# EAGLE design M783new (EAGLE 6.6.0)
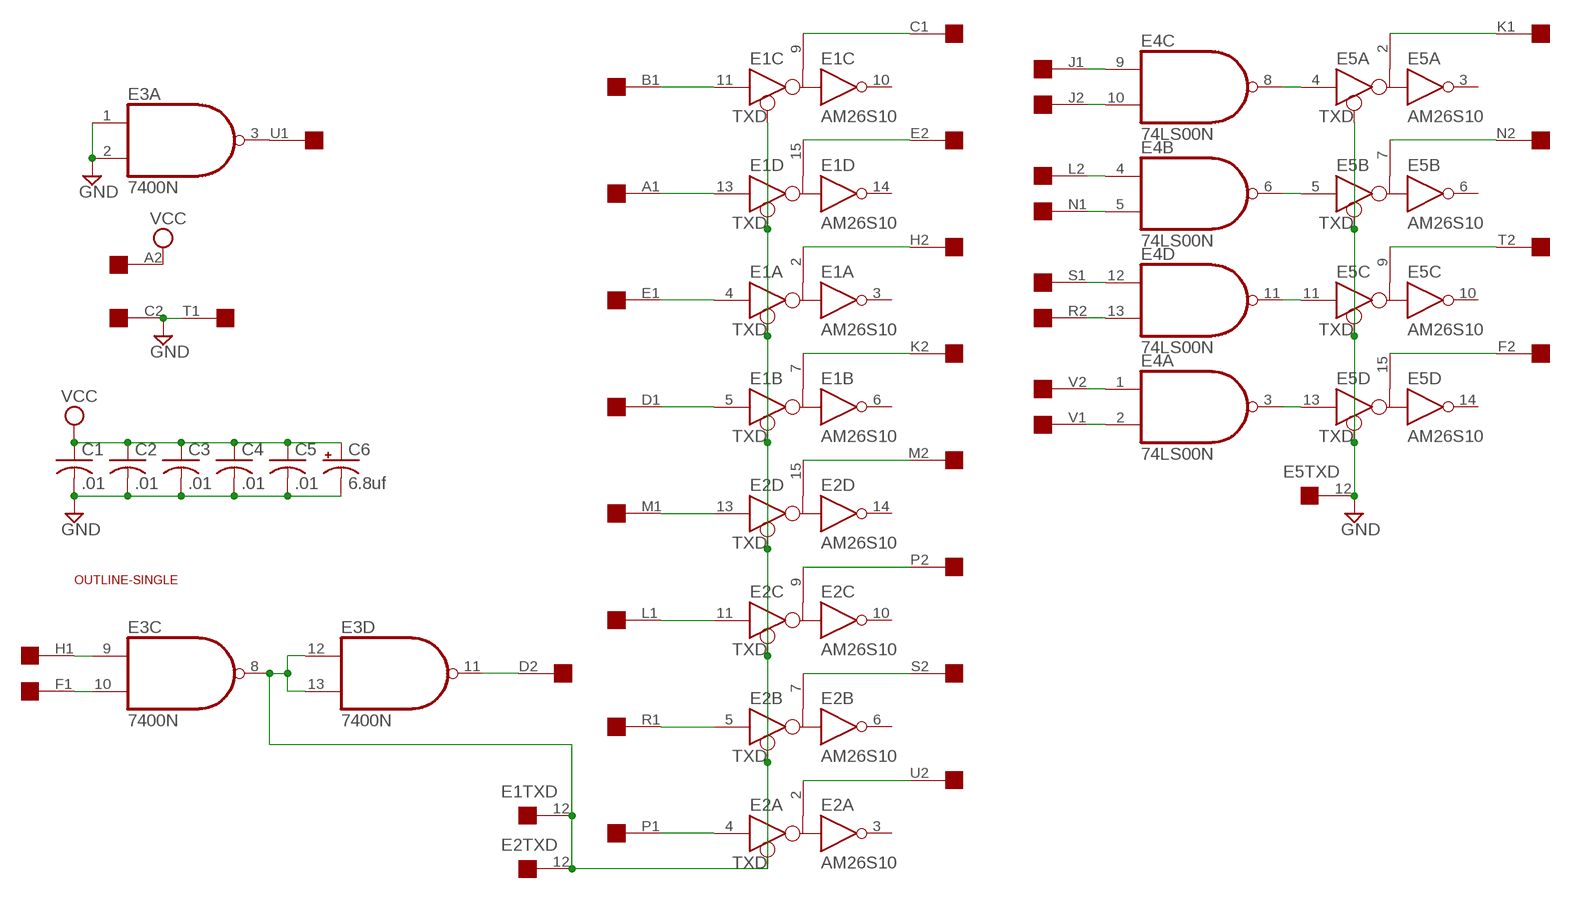
[diagram p0: schematic, sheet 1]

## Parts
C1  .01  C-US050-025X075  [C050-025X075]
C2  .01  C-US050-025X075  [C050-025X075]
C3  .01  C-US050-025X075  [C050-025X075]
C4  .01  C-US050-025X075  [C050-025X075]
C5  .01  C-US050-025X075  [C050-025X075]
C6  6.8uf  CPOL-USE15-5AXIAL  [E15-5]
E1  AM26S10  [DIL16]
E2  AM26S10  [DIL16]
E3  7400N  [DIL14]
E4  74LS00N  [DIL14]
E5  AM26S10  [DIL16]
U$1  SINGLE  [EDGE-CON2]
U$2  OUTLINE-SINGLE  [SINGLE]

## Nets
GND: C1.2 C2.2 C3.2 C4.2 C5.2 C6.- E3.1(A:I0) E3.2(A:I1) E5.12(TXD:TXD) U$1.C2 U$1.T1
N$1: E3.3(A:O) U$1.U1
N$2: E1.12(TXD:TXD) E2.12(TXD:TXD) E3.8(C:O) E3.12(D:I0) E3.13(D:I1)
N$3: E2.15(D:B) U$1.M2
N$4: E2.9(C:B) U$1.P2
N$5: E2.4(A:D) U$1.P1
N$6: E2.5(B:D) U$1.R1
N$7: E2.7(B:B) U$1.S2
N$8: E2.11(C:D) U$1.L1
N$9: E2.2(A:B) U$1.U2
N$10: E2.13(D:D) U$1.M1
N$11: E1.9(C:B) U$1.C1
N$12: E1.11(C:D) U$1.B1
N$13: E1.15(D:B) U$1.E2
N$14: E1.13(D:D) U$1.A1
N$15: E1.2(A:B) U$1.H2
N$16: E1.4(A:D) U$1.E1
N$17: E1.7(B:B) U$1.K2
N$18: E1.5(B:D) U$1.D1
N$19: E3.11(D:O) U$1.D2
N$20: E5.7(B:B) U$1.N2
N$21: E5.9(C:B) U$1.T2
N$22: E5.15(D:B) U$1.F2
N$23: E5.2(A:B) U$1.K1
N$24: E4.9(C:I0) U$1.J1
N$25: E4.10(C:I1) U$1.J2
N$26: E4.4(B:I0) U$1.L2
N$27: E4.5(B:I1) U$1.N1
N$28: E4.12(D:I0) U$1.S1
N$29: E4.13(D:I1) U$1.R2
N$31: E3.9(C:I0) U$1.H1
N$32: E3.10(C:I1) U$1.F1
N$33: E4.1(A:I0) U$1.V2
N$34: E4.2(A:I1) U$1.V1
N$35: E4.8(C:O) E5.4(A:D)
N$36: E4.6(B:O) E5.5(B:D)
N$37: E4.11(D:O) E5.11(C:D)
N$38: E4.3(A:O) E5.13(D:D)
VCC: C1.1 C2.1 C3.1 C4.1 C5.1 C6.+ U$1.A2
Unconnected: E1.3(A:R) E1.6(B:R) E1.10(C:R) E1.14(D:R) E2.3(A:R) E2.6(B:R) E2.10(C:R) E2.14(D:R) E3.4(B:I0) E3.5(B:I1) E3.6(B:O) E5.3(A:R) E5.6(B:R) E5.10(C:R) E5.14(D:R) U$1.B2

## Power pins joined to a net without a drawn wire
GND: E1.1(GND:GND) E1.8(PWR:GND) E2.1(GND:GND) E2.8(PWR:GND) E3.7(P:GND) E4.7(P:GND) E5.1(GND:GND) E5.8(PWR:GND)
VCC: E1.16(PWR:VCC) E2.16(PWR:VCC) E3.14(P:VCC) E4.14(P:VCC) E5.16(PWR:VCC)

## Library data of the parts
C1-C5 = rcl:C-US: CAPACITOR, American symbol
C6 = rcl:CPOL-US: POLARIZED CAPACITOR, American symbol
E1 E2 E5 = dec-con:AM26S10: Bus Transceiver
E3 E4 = 74xx-us:74*00: Quad 2-input NAND gate
U$1 = dec-con:SINGLE: Single-Height DEC board
U$2 = dec-con:OUTLINE-*: Board outlines for DEC boards.

## Board
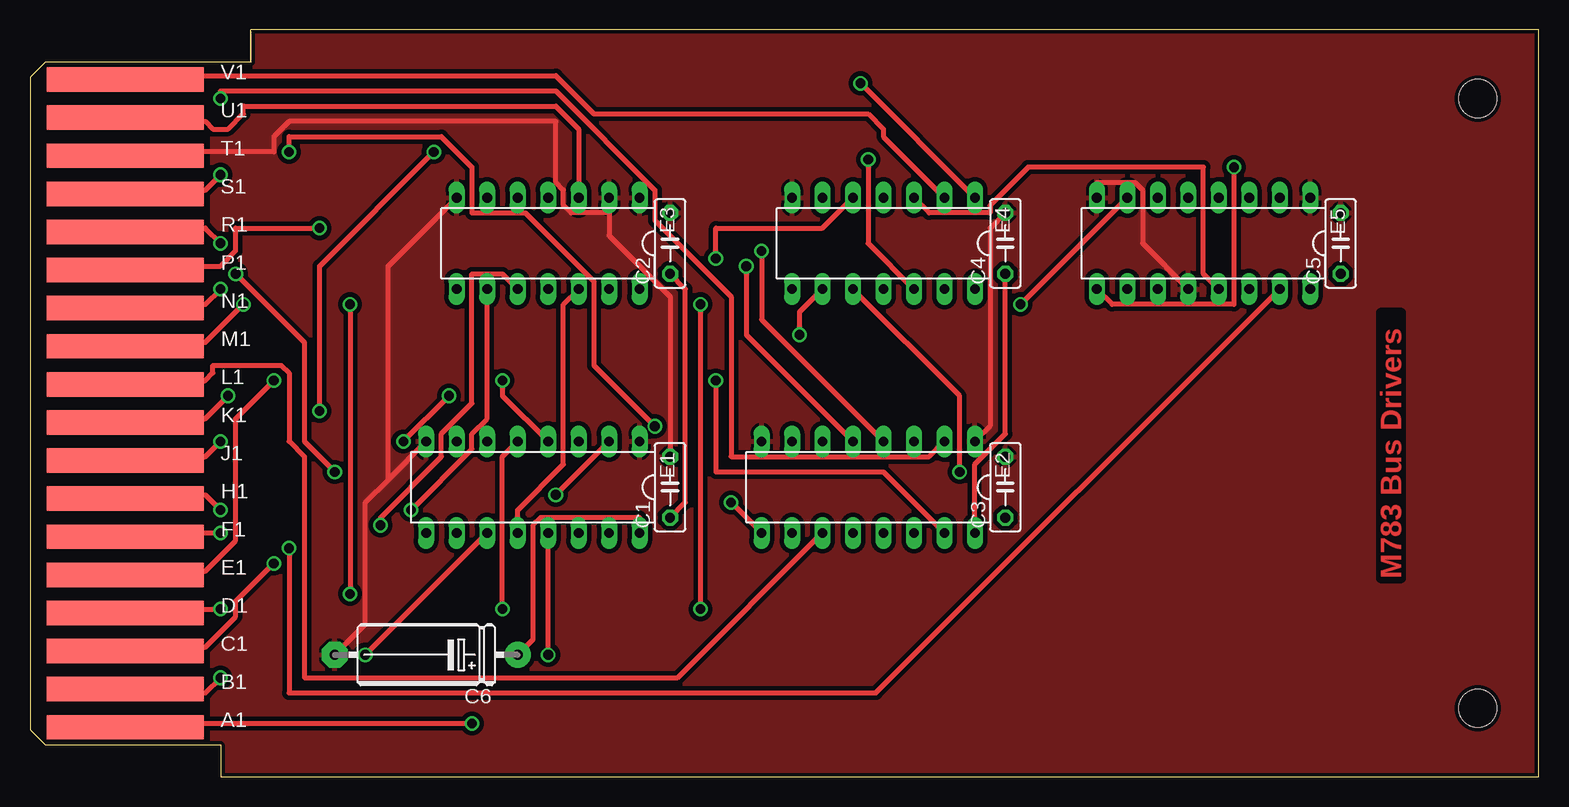
[diagram p1: board, top side]
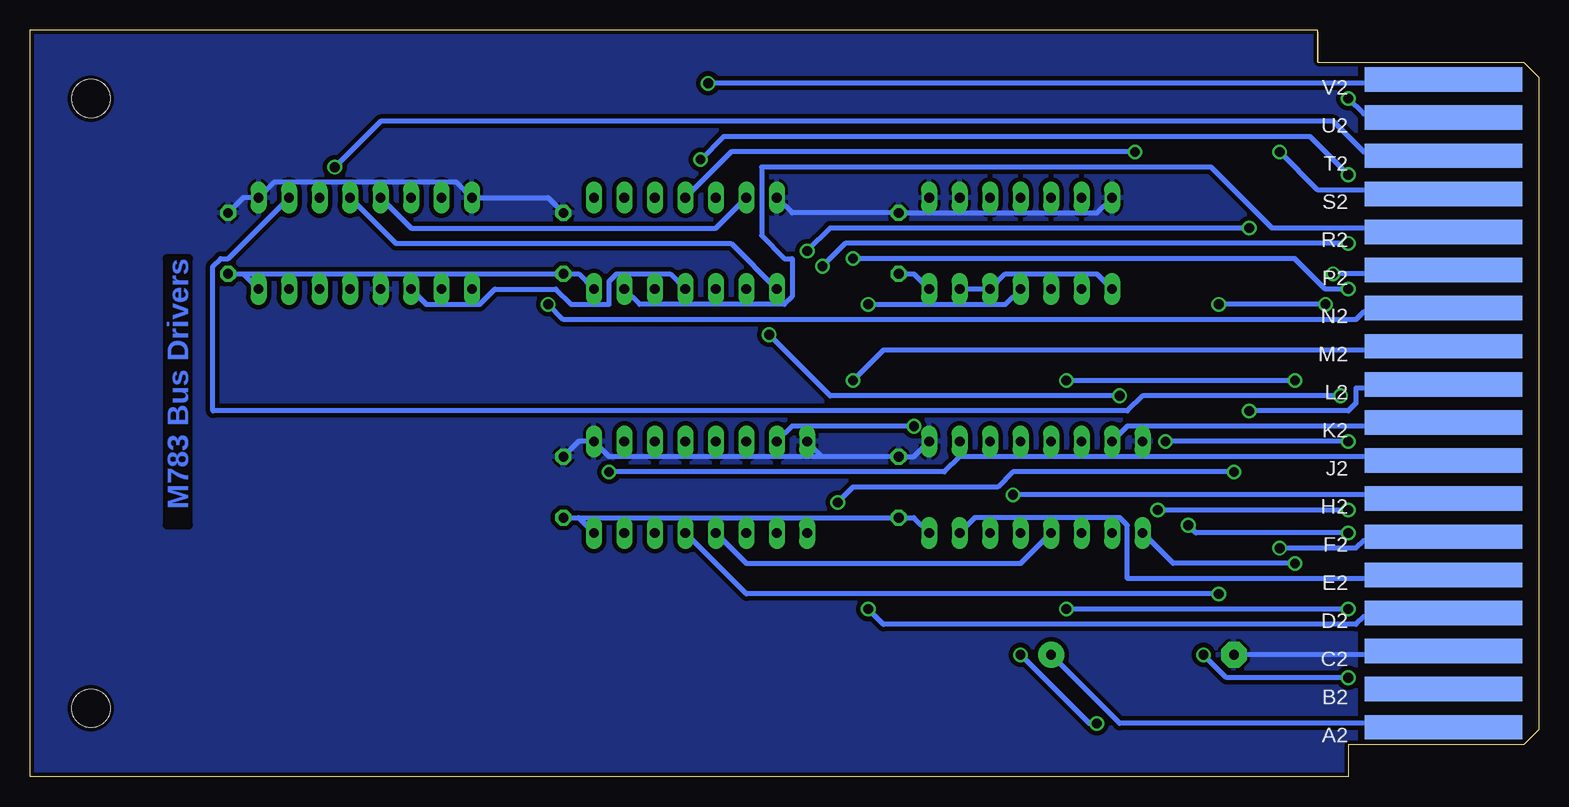
[diagram p2: board, bottom side, seen from below]

Size 125.73 x 62.23 mm. Coordinates in mm from the lower left corner, seen from the top.
Copper layers (1+16): Top 0.035mm / dielectric 1.5mm / Bottom 0.035mm
Design rules "16mils": minimum track width 16mil, minimum drill 32mil, track to track 15mil, track to pad 10mil, pad to pad 10mil, via to via 10mil, smd to smd 10mil, copper to edge 13mil, drill to drill 10mil, minimum pad ring 10mil, minimum via ring 8mil, stop-mask expansion 0mil, vias tented up to drill 0mil, thermal gap 10mil

### Footprints (pad centres in the part's own frame; a part is rotated, then mirrored left to right if it is on the bottom)
C050-025X075 = drill 0.813 octagon: 1 -2.54,0; 2 2.54,0
E15-5 = drill 0.813 pad 2.159: + -7.62,0 | drill 0.813 pad 2.159 octagon: - 7.62,0
DIL16 = drill 0.813 long: 1 -8.89,-3.81; 2 -6.35,-3.81; 3 -3.81,-3.81; 4 -1.27,-3.81; 5 1.27,-3.81; 6 3.81,-3.81; 7 6.35,-3.81; 8 8.89,-3.81; 9 8.89,3.81; 10 6.35,3.81; 11 3.81,3.81; 12 1.27,3.81; 13 -1.27,3.81; 14 -3.81,3.81; 15 -6.35,3.81; 16 -8.89,3.81
DIL14 = drill 0.813 long: 1 -7.62,-3.81; 2 -5.08,-3.81; 3 -2.54,-3.81; 4 0,-3.81; 5 2.54,-3.81; 6 5.08,-3.81; 7 7.62,-3.81; 8 7.62,3.81; 9 5.08,3.81; 10 2.54,3.81; 11 0,3.81; 12 -2.54,3.81; 13 -5.08,3.81; 14 -7.62,3.81
EDGE-CON2 = smd 13.106 x 2.032: A1 7.938,4.128; B1 7.938,7.303; C1 7.938,10.477; D1 7.938,13.652; E1 7.938,16.828; F1 7.938,20.003; H1 7.938,23.177; J1 7.938,26.352; K1 7.938,29.527; L1 7.938,32.703; M1 7.938,35.877; N1 7.938,39.053; P1 7.938,42.227; R1 7.938,45.403; S1 7.938,48.578; T1 7.938,51.752; U1 7.938,54.928; V1 7.938,58.102 | smd 13.106 x 2.032 bottom: A2 7.938,4.128; B2 7.938,7.303; C2 7.938,10.477; D2 7.938,13.652; E2 7.938,16.828; F2 7.938,20.003; H2 7.938,23.177; J2 7.938,26.352; K2 7.938,29.527; L2 7.938,32.703; M2 7.938,35.877; N2 7.938,39.053; P2 7.938,42.227; R2 7.938,45.403; S2 7.938,48.578; T2 7.938,51.752; U2 7.938,54.928; V2 7.938,58.102
SINGLE = hole 3.175: 120.65,56.515; 120.65,5.715

### Placement (x,y rotation side)
C1  53.34,24.13 90 top
C2  53.34,44.45 90 top
C3  81.28,24.13 90 top
C4  81.28,44.45 90 top
C5  109.22,44.45 90 top
C6  33.02,10.16 180 top
E1  41.91,24.13 180 top
E2  69.85,24.13 180 top
E3  43.18,44.45 180 top
E4  71.12,44.45 180 top
E5  97.79,44.45 180 top
U$1  0,0 0 top
U$2  0,0 0 top

### Tracks (layer width: path | path; a pad name or v marks a point on that pad's centre or on a via)
GND
  Top 0.406: E5.12 92.71,44.45 92.71,48.9 92.08,49.53 88.9,49.53 E5.8 | E2.1 80.01,29.21 80.01,45.72 C4.2 | 29.85,24.77 27.94,22.86 27.94,12.7 C6.- | 29.85,24.77 E1.8 | E3.7 29.85,42.55 29.85,24.77 | 48.26,46.99 45.09,46.99 44.45,47.62 44.45,48.9 43.82,49.53 43.82,54.61 21.59,54.61 20.32,53.34 20.32,52.07 8.26,52.07 U$1.T1 | E3.2 48.26,46.99 | C1.2 53.34,40.01 48.26,45.09 48.26,46.99
  Bottom 0.406: C3.2 80.01,27.94 E2.1 77.47,26.67 59.69,26.67 | E1.1 52.07,26.67 C1.2 59.69,26.67 | 59.69,26.67 E2.8 | C5.2 107.95,48.26 E5.1 105.41,49.53 90.17,49.53 E5.8 82.55,48.26 C4.2 | E3.7 36.83,46.99 48.26,46.99 | 50.8,46.99 C2.2 62.23,46.99 E4.7 | 50.8,46.99 48.26,46.99 | 48.26,46.99 E3.2 | 50.8,46.99 E3.1 | C6.- 8.26,10.16 U$1.C2
  pour Bottom (isolate 0.305): 15.24,62.23 125.73,62.23 125.73,0 15.24,0
  pour Top (isolate 0.305): 15.24,62.23 125.73,62.23 125.73,0 15.24,0
N$1
  Top 0.406: E3.3 45.72,53.98 43.82,55.88 17.78,55.88 17.78,55.24 16.51,53.98 15.24,53.98 14.61,54.61 8.26,54.61 U$1.U1
N$2
  Top 0.406: E3.12 44.45,39.37 44.45,26.04 40.64,22.23 E1.12
  Bottom 0.406: E3.8 36.83,41.91 44.45,41.91 E3.12 E3.13 | E1.12 43.18,17.78 66.04,17.78 E2.12
N$3  (via drill 0.81)
  Top 0.406: E2.15 71.12,25.4 57.15,25.4 v57.15,33.02
  Bottom 0.406: v57.15,33.02 54.61,35.56 8.26,35.56 U$1.M2
N$4  (via drill 0.81)
  Top 0.406: v58.42,22.86 E2.9 | v25.4,25.4 22.86,27.94 22.86,36.2 v17.15,41.91
  Bottom 0.406: v58.42,22.86 57.15,24.13 45.09,24.13 43.82,25.4 v25.4,25.4 | v17.15,41.91 8.26,41.91 U$1.P2
N$5  (via drill 0.81)
  Top 0.406: E2.4 60.96,38.1 v60.96,43.81 | v24.13,45.72 17.15,45.72 17.15,43.81 15.88,42.55 8.26,42.55 U$1.P1
  Bottom 0.406: v60.96,43.81 59.06,45.72 v24.13,45.72
N$6  (via drill 0.81)
  Top 0.406: E2.5 59.69,36.83 v59.69,42.55 | v15.88,44.45 14.61,45.72 8.26,45.72 U$1.R1
  Bottom 0.406: v59.69,42.55 57.79,44.45 v15.88,44.45
N$7  (via drill 0.81)
  Top 0.406: v52.07,29.21 46.99,34.29 46.99,41.27 41.28,46.99 36.83,46.99 36.83,50.8 34.29,53.34 21.59,53.34 v21.59,52.07
  Bottom 0.406: E2.7 62.23,29.21 v52.07,29.21 | v21.59,52.07 18.42,48.9 8.26,48.9 U$1.S2
N$8
  Top 0.406: E2.11 53.98,8.26 22.86,8.26 22.86,26.67 21.59,27.94 21.59,33.66 20.96,34.29 15.24,34.29 15.24,33.66 14.61,33.02 8.26,33.02 U$1.L1
N$9  (via drill 0.81)
  Top 0.406: E2.2 74.93,26.67 58.42,26.67 58.42,40.01 52.07,46.35 52.07,48.9 43.82,57.15 15.88,57.15 v15.88,56.52
  Bottom 0.406: v15.88,56.52 14.61,55.24 8.26,55.24 U$1.U2
N$10  (via drill 0.81)
  Top 0.406: v26.67,39.37 v26.67,15.24 | v17.78,39.37 14.61,36.2 8.26,36.2 U$1.M1
  Bottom 0.406: E2.13 66.04,15.24 v26.67,15.24 | v17.78,39.37 v26.67,39.37
N$11  (via drill 0.81)
  Top 0.406: v20.32,17.78 17.15,14.61 17.15,13.34 14.61,10.79 8.26,10.79 U$1.C1
  Bottom 0.406: E1.9 30.48,17.78 v20.32,17.78
N$12  (via drill 0.81)
  Top 0.406: v27.94,10.16 E1.11 | v15.88,8.26 14.61,6.99 8.26,6.99 U$1.B1
  Bottom 0.406: v27.94,10.16 26.04,8.26 v15.88,8.26
N$13
  Bottom 0.406: E1.15 46.99,21.59 34.93,21.59 34.29,20.95 34.29,16.51 8.26,16.51 U$1.E2
N$14  (via drill 0.81)
  Top 0.406: v43.18,10.16 E1.13 | v36.83,4.45 8.26,4.45 U$1.A1
  Bottom 0.406: v43.18,10.16 37.47,4.45 v36.83,4.45
N$15  (via drill 0.81)
  Top 0.406: v43.82,23.5 E1.2
  Bottom 0.406: v43.82,23.5 8.26,23.5 U$1.H2
N$16  (via drill 0.81)
  Top 0.406: E1.4 39.37,31.75 v39.37,33.02 | v20.32,33.02 17.15,29.84 17.15,19.68 14.61,17.14 8.26,17.14 U$1.E1
  Bottom 0.406: v20.32,33.02 v39.37,33.02
N$17
  Bottom 0.406: E1.7 34.29,29.21 8.26,29.21 U$1.K2
N$18  (via drill 0.81)
  Top 0.406: E1.5 39.37,26.67 v39.37,13.97 | v15.88,13.97 8.26,13.97 U$1.D1
  Bottom 0.406: v15.88,13.97 v39.37,13.97
N$19  (via drill 0.81)
  Top 0.406: v55.88,13.97 v55.88,39.37
  Bottom 0.406: E3.11 44.45,39.37 v55.88,39.37 | v55.88,13.97 54.61,12.7 15.24,12.7 14.61,13.34 8.26,13.34 U$1.D2
N$20  (via drill 0.81)
  Top 0.406: v82.55,39.37 E5.7
  Bottom 0.406: v82.55,39.37 81.28,38.1 15.24,38.1 14.61,38.73 8.26,38.73 U$1.N2
N$21  (via drill 0.81)
  Top 0.406: E5.9 90.17,39.37 100.33,39.37 v100.33,50.8
  Bottom 0.406: v100.33,50.8 96.52,54.61 17.15,54.61 14.61,52.07 8.26,52.07 U$1.T2
N$22  (via drill 0.81)
  Top 0.406: E5.15 70.49,6.99 21.59,6.99 v21.59,19.05
  Bottom 0.406: v21.59,19.05 15.24,19.05 14.61,19.68 8.26,19.68 U$1.F2
N$23  (via drill 0.81)
  Top 0.406: v16.51,31.75 14.61,29.84 8.26,29.84 U$1.K1
  Bottom 0.406: E5.2 109.22,43.18 109.86,43.18 110.49,42.55 110.49,30.48 34.29,30.48 33.02,31.75 v16.51,31.75
N$24  (via drill 0.81)
  Top 0.406: E4.9 64.14,38.73 v64.14,36.83 | v31.12,27.94 v34.93,31.75 | v15.88,27.94 14.61,26.67 8.26,26.67 U$1.J1
  Bottom 0.406: v64.14,36.83 59.06,31.75 v34.93,31.75 | v15.88,27.94 v31.12,27.94
N$25  (via drill 0.81)
  Top 0.406: E4.10 77.47,31.75 v77.47,25.4
  Bottom 0.406: v77.47,25.4 49.53,25.4 48.26,26.67 8.26,26.67 U$1.J2
N$26  (via drill 0.81)
  Top 0.406: v33.66,52.07 24.13,42.55 v24.13,30.48
  Bottom 0.406: E4.4 67.31,52.07 v33.66,52.07 | v24.13,30.48 15.88,30.48 15.24,31.11 15.24,32.38 8.26,32.38 U$1.L2
N$27  (via drill 0.81)
  Top 0.406: E4.5 66.04,45.72 57.15,45.72 v57.15,43.18 | v15.88,40.64 14.61,39.37 8.26,39.37 U$1.N1
  Bottom 0.406: v57.15,43.18 20.32,43.18 17.78,40.64 v15.88,40.64
N$28  (via drill 0.81)
  Top 0.406: E4.12 69.85,44.45 v69.85,51.44 | v15.88,50.16 14.61,48.9 8.26,48.9 U$1.S1
  Bottom 0.406: v69.85,51.44 67.95,53.34 19.05,53.34 v15.88,50.16
N$29
  Bottom 0.406: E4.13 74.93,39.37 62.87,39.37 62.23,40.01 62.23,43.18 62.87,43.18 64.77,45.09 64.77,50.8 27.31,50.8 22.23,45.72 8.26,45.72 U$1.R2
N$31  (via drill 0.81)
  Top 0.406: E3.9 38.1,29.84 36.83,28.57 36.83,27.3 v31.75,22.23 | v15.88,22.23 14.61,23.5 8.26,23.5 U$1.H1
  Bottom 0.406: v15.88,22.23 v31.75,22.23
N$32  (via drill 0.81)
  Top 0.406: E3.10 39.37,41.91 36.83,41.91 36.83,31.11 34.29,28.57 34.29,26.67 29.21,21.59 v29.21,20.95 | v15.88,20.32 8.26,20.32 U$1.F1
  Bottom 0.406: v29.21,20.95 28.58,20.32 v15.88,20.32
N$33  (via drill 0.81)
  Top 0.406: v69.22,57.78 E4.1
  Bottom 0.406: v69.22,57.78 8.26,57.78 U$1.V2
N$34
  Top 0.406: E4.2 71.12,53.34 71.12,53.98 69.85,55.24 46.99,55.24 43.82,58.42 8.26,58.42 U$1.V1
N$35
  Bottom 0.406: E4.8 67.31,44.45 95.25,44.45 E5.4
N$36
  Bottom 0.406: E4.6 68.58,45.72 93.98,45.72 E5.5
N$37
  Bottom 0.406: E4.11 72.39,41.91 76.84,41.91 77.47,41.27 77.47,39.37 80.65,39.37 81.92,40.64 87,40.64 88.27,39.37 92.71,39.37 E5.11
N$38
  Top 0.406: E4.3 74.93,46.99 80.01,46.99 80.01,47.62 83.19,50.8 97.79,50.8 97.79,41.91 E5.13
VCC
  Top 0.406: C2.1 54.61,40.64 54.61,22.86 C1.1 | C4.1 81.28,28.57 78.74,26.04 E2.16 | C6.+ 41.91,11.43 41.91,20.95 42.55,21.59 50.8,21.59 E1.16
  Bottom 0.406: C6.+ 34.93,4.45 8.26,4.45 U$1.A2 | E4.14 80.01,41.91 C4.1 107.95,41.91 | 107.95,41.91 E5.16 | C5.1 107.95,41.91 | E3.14 52.07,41.91 C2.1 | E1.16 52.07,21.59 C1.1 80.01,21.59 | 80.01,21.59 E2.16 | C3.1 80.01,21.59

### Text on the board
Top: M783 Bus Drivers
Bottom: M783 Bus Drivers